# Altium schematic sheet 3v3_dcdc_blk.SchDoc
size A4; Engineer: JBayalas; DocumentNumber: 12; Revision: V1.1; SheetNumber: 12; SheetTotal: 13
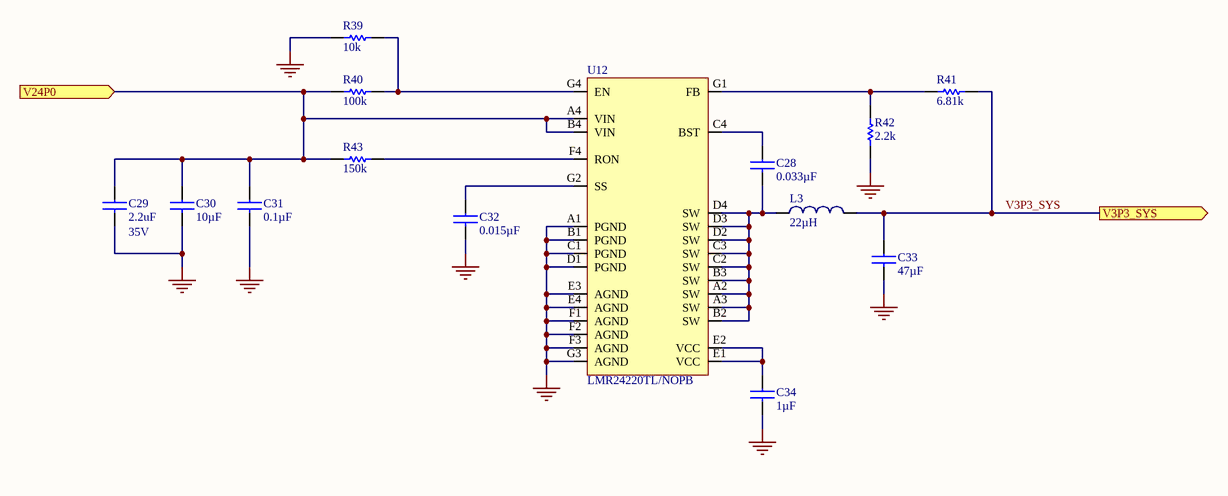
[diagram p0: 3v3_dcdc_blk.SchDoc]

## Parts
C28  value 0.033µF  [C0402]  (hidden comment: *)
C29  value 2.2uF  RATING: 35V  [C0603]  (hidden comment: *)
C30  value 10µF  [C1210]  (hidden comment: *)
C31  value 0.1µF  [C0805]  (hidden comment: *)
C32  value 0.015µF  [C0402]  (hidden comment: *)
C33  value 47µF  [C1206]  (hidden comment: *)
C34  value 1µF  [C0603]  (hidden comment: *)
L3  value 22µH  [MPI4040R3-220-R]  (hidden comment: MPI4040R3-220-R)
R39  value 10k  [R0402]  (hidden comment: *)
R40  value 100k  [R0402]  (hidden comment: *)
R41  value 6.81k  [R0402]  (hidden comment: *)
R42  value 2.2k  [R0402]  (hidden comment: *)
R43  value 150k  [R0402]  (hidden comment: *)
U12  *  [DSBGA-28]  (value not drawn)

## Ports
V3P3_SYS (out), V24P0 (in)

## Nets
GND: C29.2 C30.2 C31.2 C32.2 C33.2 C34.2 R39.1 R42.1 U12.A1(PGND) U12.B1(PGND) U12.C1(PGND) U12.D1(PGND) U12.E3(AGND) U12.E4(AGND) U12.F1(AGND) U12.F2(AGND) U12.F3(AGND) U12.G3(AGND)
V3P3_SYS: C33.1 L3.1 R41.2 ; port V3P3_SYS
V24P0: C29.1 C30.1 C31.1 R40.2 R43.2 U12.A4(VIN) U12.B4(VIN) ; port V24P0
NetC28_1: C28.1 U12.C4(BST)
NetC28_2: C28.2 L3.2 U12.A2(SW) U12.A3(SW) U12.B2(SW) U12.B3(SW) U12.C2(SW) U12.C3(SW) U12.D2(SW) U12.D3(SW) U12.D4(SW)
NetC32_1: C32.1 U12.G2(SS)
NetC34_1: C34.1 U12.E1(VCC) U12.E2(VCC)
NetR39_2: R39.2 R40.1 U12.G4(EN)
NetR41_1: R41.1 R42.2 U12.G1(FB)
NetR43_1: R43.1 U12.F4(RON)

## Notes on the sheet
- Title:
- Sheet:
- Date:
- of
- Project:
- Revision:
- Engineer:
- Wi4B S.r.l

## Library data of the parts
C28 = GRM155R71E333KA88D: CAP CER 0.033UF 25V X7R 0402; MFT: Murata; TYPE: Surface Mount; FUNCTION: 3v3_dcdc; MPN: GRM155R71E333KA88D; RATING: 25V
C29 = C1608X5R1V225K080AC: CAP CER 2.2UF 35V X5R 0603; MFT: TDK Corporation; TYPE: SMD; FUNCTION: 3v3_dcdc; MPN: C1608X5R1V225K080AC; LOAD: *
C30 = GRM32ER7YA106KA12L: CAP CER 10UF 35V X7R 1210; MFT: Murata Electronics North America; TYPE: Surface Mount, MLCC; FUNCTION: 3v3_dcdc; MPN: GRM32ER7YA106KA12L; RATING: 35V
C31 = C0805C104K5RACTU: CAP CER 0.1UF 50V X7R 0805; MFT: Kemet; TYPE: Surface Mount, MLCC; FUNCTION: 3v3_dcdc; MPN: C0805C104K5RACTU; RATING: 50V
C32 = GRM155R71E153KA61D: CAP CER 0.015UF 25V X7R 0402; TYPE: Surface Mount, MLCC; MFT: Murata Electronics North America; FUNCTION: 3v3_dcdc; RATING: 25V; MPN: GRM155R71E153KA61D
C33 = GRM31CR61A476KE15L: CAP CER 47UF 10V X5R 1206; MFT: Murata Electronics North America; TYPE: Surface Mount, MLCC; FUNCTION: 3v3_dcdc; MPN: GRM31CR61A476KE15L; RATING: 10V
C34 = GRM188R61E105KA12D: CAP CER 1UF 25V X5R 0603; MFT: Murata Electronics North America; TYPE: Surface Mount; FUNCTION: 3v3_dcdc; MPN: GRM188R61E105KA12D; RATING: 25V
L3 = MPI4040R3-220-R: FIXED IND 22UH 1.1A 408 MOHM SMD; MFT: Eaton Bussmann; FUNCTION: 3v3_dcdc; MPN: MPI4040R3-220-R; TYPE: SMD; RATING: 1.1A 408 MOHM; DNP: *
R39 = CRCW040210K0JNED: RES SMD 10K OHM 5% 1/16W 0402; MFT: Vishay Dale; RATING: 0.063W, 1/16W; FUNCTION: 3v3_dcdc; MPN: CRCW040210K0JNED; TYPE: Surface Mount
R40 = CRCW0402100KFKED: RES SMD 100K OHM 1% 1/16W 0402; RATING: 0.063W; MFT: Vishay Dale; FUNCTION: 3v3_dcdc; TYPE: Surface Mount; MPN: CRCW0402100KFKED
R41 = RT0402BRD076K81L: RES SMD 6.81KOHM 0.1% 1/16W 0402; MFT: Yageo; FUNCTION: 3v3_dcdc; MPN: RT0402BRD076K81L; RATING: 1/16W; LOAD: *; TYPE: SMD
R42 = ERJ-2RKF2201X: RES SMD 2.2K OHM 1% 1/10W 0402; MFT: Panasonic Electronic Components; RATING: 0.1W, 1/10W; FUNCTION: 3v3_dcdc; MPN: ERJ-2RKF2201X; TYPE: Surface Mount
R43 = CRCW0402150KFKED: RES SMD 150K OHM 1% 1/16W 0402; MFT: Vishay Dale; RATING: 63mW; FUNCTION: 3v3_dcdc; MPN: CRCW0402150KFKED; TYPE: Surface Mount
U12 = LMR24220TL/NOPB: Voltage Regulators - Switching Regulators 42VIN,2A SIMPLE SW NANO STEP-DOWN REG; MFT: Texas Instruments; FUNCTION: 3v3_dcdc; TYPE: Surface Mount; VALUE: LMR24220TL/NOPB; MPN: LMR24220TL/NOPB